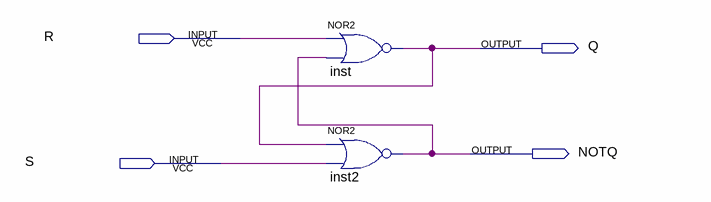
[diagram p0: schematic sheet]
// Quartus schematic srlatch.bdf as structural Verilog: 2 symbols, 4 pins
module srlatch (
  input  R,
  input  S,
  output Q,
  output NOTQ
);

  nor inst (Q, R, NOTQ);
  nor inst2 (NOTQ, Q, S);
endmodule
